# EAGLE design NodeMCU AQM-4 (EAGLE 9.6.2)
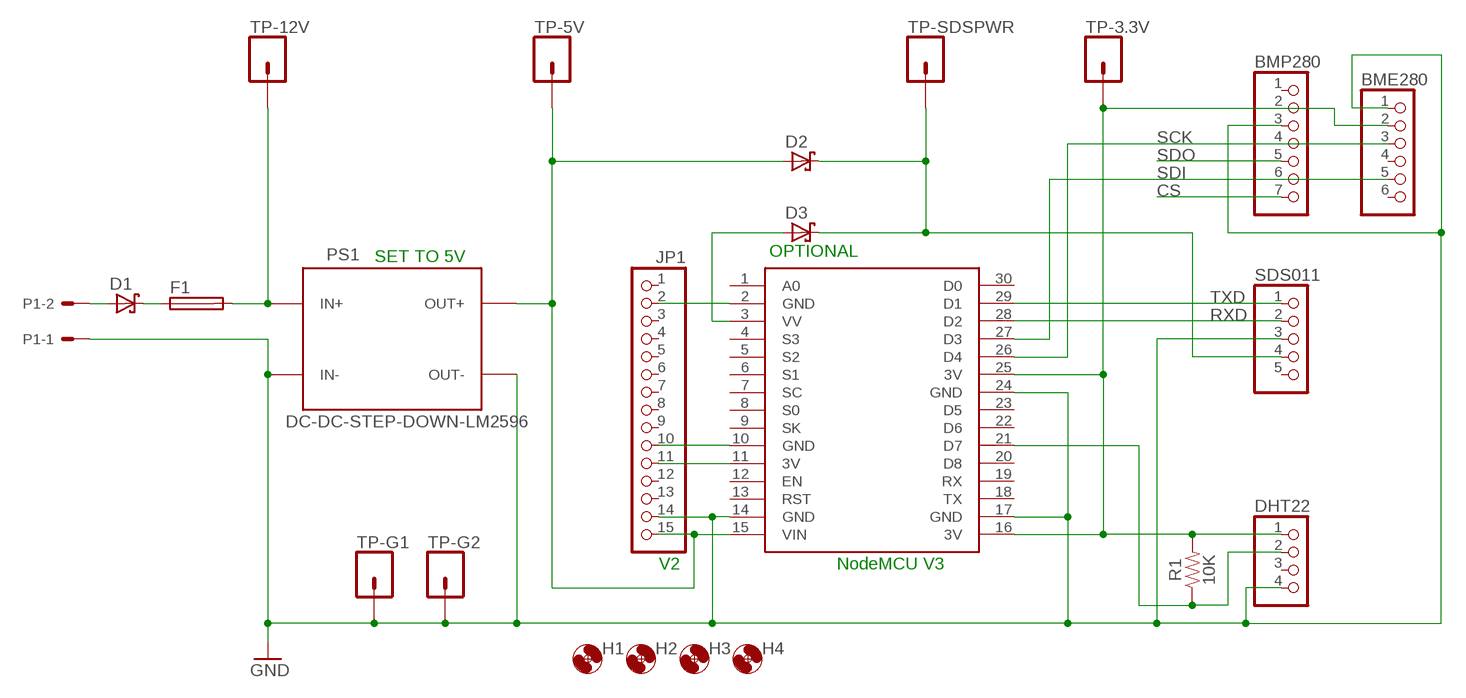
[diagram p0: schematic, sheet 1]

## Parts
BME280  PINHD-1X6  [1X06]
BMP280  PINHD-1X7  [1X07]
D1  SCHOTTKY-DIODEF126Z12  [DIODE_F126Z12]
D2  SCHOTTKY-DIODEF126Z12  [DIODE_F126Z12]
D3  SCHOTTKY-DIODEF126Z12  [DIODE_F126Z12]
DHT22  PINHD-1X4  [1X04]
F1  SH22,5A  [SH22,5A]
H1  MOUNT-HOLE3.6  [3,6]
H2  MOUNT-HOLE3.6  [3,6]
H3  MOUNT-HOLE3.6  [3,6]
H4  MOUNT-HOLE3.6  [3,6]
JP1  PINHD-1X15  [1X15]
P1  KK-156-2  [KK-156-2]
PS1  DC-DC-STEP-DOWN-LM2596  [DC-DC-STEP-DOWN-LM2596]
R1  10K  1KOHM-HORIZ-1/4W-5%  [AXIAL-0.3]
SDS011  PINHD-1X5  [1X05]
TP-3.3V  CONN_01OFFSET  [1X01_OFFSET]
TP-5V  CONN_01OFFSET  [1X01_OFFSET]
TP-12V  CONN_01OFFSET  [1X01_OFFSET]
TP-G1  CONN_01OFFSET  [1X01_OFFSET]
TP-G2  CONN_01OFFSET  [1X01_OFFSET]
TP-SDSPWR  CONN_01OFFSET  [1X01_OFFSET]
U$1  NODEMCU  [NODEMCU]

## Nets
3V3 [pwrgnd]: BME280.2 BMP280.2 DHT22.1 JP1.11 R1.P$2 TP-3.3V.1 U$1.11(3V) U$1.16(3V) U$1.25(3V)
CS: BMP280.7
GND [pwrgnd]: BME280.1 BMP280.3 DHT22.4 JP1.2 JP1.10 JP1.14 P1.1 PS1.IN- PS1.OUT- SDS011.3 TP-G1.1 TP-G2.1 U$1.2(GND) U$1.10(GND) U$1.14(GND) U$1.17(GND) U$1.24(GND)
N$1: D2.A(C) JP1.15 PS1.OUT+ TP-5V.1 U$1.15(VIN)
N$2: D3.A(C) U$1.3(VV)
N$3: D1.A(C) P1.2
N$15: D1.C(A) F1.1
N$16: F1.2 PS1.IN+ TP-12V.1
N$19: DHT22.2 R1.P$1 U$1.21(D7)
RXD: SDS011.2 U$1.28(D2)
SCK: BME280.3 BMP280.4 U$1.26(D4)
SDI: BME280.5 BMP280.6 U$1.27(D3)
SDO: BMP280.5
SDSPWR [pwrgnd]: D2.C(A) D3.C(A) SDS011.4 TP-SDSPWR.1
TXD: SDS011.1 U$1.29(D1)
Unconnected: BME280.4 BME280.6 BMP280.1 DHT22.3 JP1.1 JP1.3 JP1.4 JP1.5 JP1.6 JP1.7 JP1.8 JP1.9 JP1.12 JP1.13 SDS011.5 U$1.1(A0) U$1.4(S3) U$1.5(S2) U$1.6(S1) U$1.7(SC) U$1.8(S0) U$1.9(SK) U$1.12(EN) U$1.13(RST) U$1.18(TX) U$1.19(RX) U$1.20(D8) U$1.22(D6) U$1.23(D5) U$1.30(D0)

## Notes on the sheet
- OPTIONAL
- SET TO 5V
- V2 | NodeMCU V3

## Library data of the parts
BME280 = pinhead:PINHD-1X6: PIN HEADER
BMP280 = pinhead:PINHD-1X7: PIN HEADER
D1-D3 = eagle-ltspice:SCHOTTKY-DIODE: Schottky Diode; SPICEMODEL: NONE; SPICEPREFIX: D; SPICETYPE: diode
DHT22 = pinhead:PINHD-1X4: PIN HEADER
F1 = fuse:SH22,5A: FUSE HOLDER grid 22,5mm, isolated cap OGN0031 8201, Schurter (Buerklin); MPN: 0031.7701.11; OC_FARNELL: unknown; OC_NEWARK: 04F1224
H1-H4 = holes:MOUNT-HOLE: MOUNTING HOLE with drill center marker
JP1 = adafruit:PINHD-1X15: PIN HEADER
P1 = con-molex:KK-156-2: KK 156 HEADER Source: http://www.molex.com/pdm_docs/sd/026604100_sd.pdf; MF: MOLEX; OC_FARNELL: unknown; OC_NEWARK: unknown
PS1 = diy-modules:DC-DC-STEP-DOWN-LM2596: DC/DC Step-Down Regulator based on LM2596-ADJ chip LM2596 datasheet available here: http://www.ti.com/lit/ds/symlink/lm2596.pdf Click here to find device on ebay.com <http://www.ebay.com/sch/lm2596+power+regulator>
R1 = SparkFun-Resistors:1KOHM: 1kΩ resistor A resistor is a passive two-terminal electrical component that implements electrical resistance as a circuit element. Resistors act to reduce current flow, and, at the same time, act to lower voltage levels within circuits. - Wikipedia; PROD_ID: RES-08380; VALUE: 1k
SDS011 = pinhead:PINHD-1X5: PIN HEADER
TP-3.3V TP-5V TP-12V TP-G1 TP-G2 TP-SDSPWR = SparkFun-Connectors:CONN_01: Single connection point. Often used as Generic Header-pin footprint for 0.1 inch spaced/style header connections On any of the 0.1 inch spaced packages, you can populate with these: Break Away Headers - Straight <https://www.sparkfun.com/products/116> (PRT-00116) Break Away Male Headers - Right Angle <https://www.sparkfun.com/products/553> (PRT-00553) Female Headers <https://www.sparkfun.com/products/115> (PRT-00115) Break Away Headers - Machine Pin <https://www.sparkfun.com/products/117> (PRT-00117) Break Away Female Headers - Swiss Machine Pin <https://www.sparkfun.com/products/743> (PRT-00743) This device is also useful as a general connection point to wire up your design to another part of your project. Our various solder wires solder well into these plated through hole pads. Hook-Up Wire - Assortment (Stranded, 22 AWG) <https://www.sparkfun.com/products/11375> (PRT-11375) Hook-Up Wire - Assortment (Solid Core, 22 AWG) <https://www.sparkfun.com/products/11367> (PRT-11367) View the entire wire category on our website here <https://www.sparkfun.com/categories/141> Special notes: SMTSO-256-ET is a "flush mount" nut for a 4-40 screw. We mostly use this on specialty testbeds; it is a nice way to connect hardware to your PCB at an adjustable hieght. Also note, the SNAP packages are for using a snappable style connector. We sell a baggie of snaps and they are also used on two LilyPad designs: Snap Assortment - 30 pack (male and female) <https://www.sparkfun.com/products/11347> (DEV-11347) LilyPad Arduino SimpleSnap <https://www.sparkfun.com/products/10941> (DEV-10941) LilyPad SimpleSnap Protoboard <https://www.sparkfun.com/products/10940> (DEV-10940)
U$1 = nodemcu:NODEMCU

## Net classes
0 default: width 0.203 mm, clearance 0.203 mm
1 pwrgnd: width 0.508 mm, clearance 0.305 mm

## Board
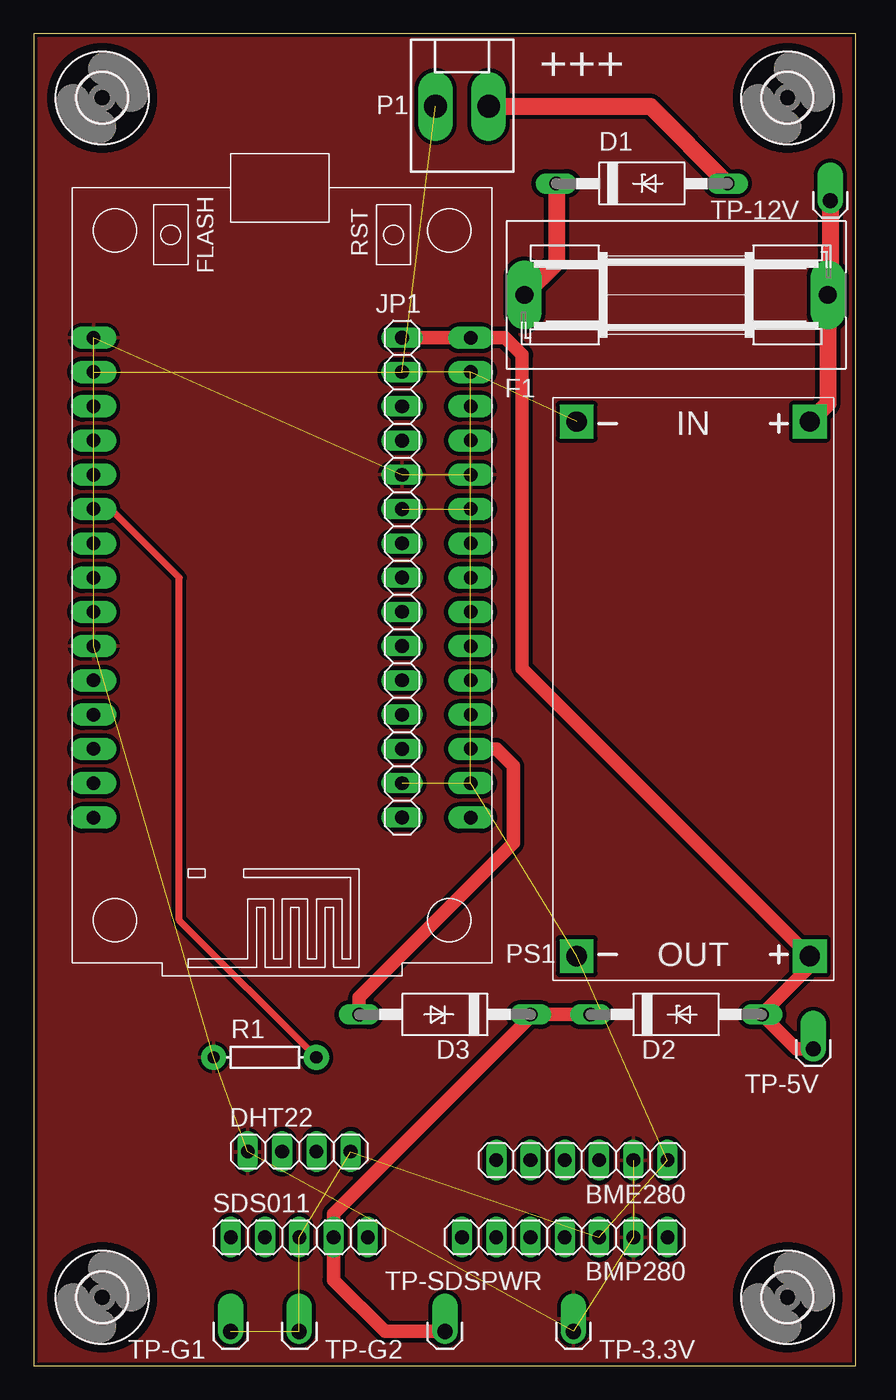
[diagram p1: board, top side]
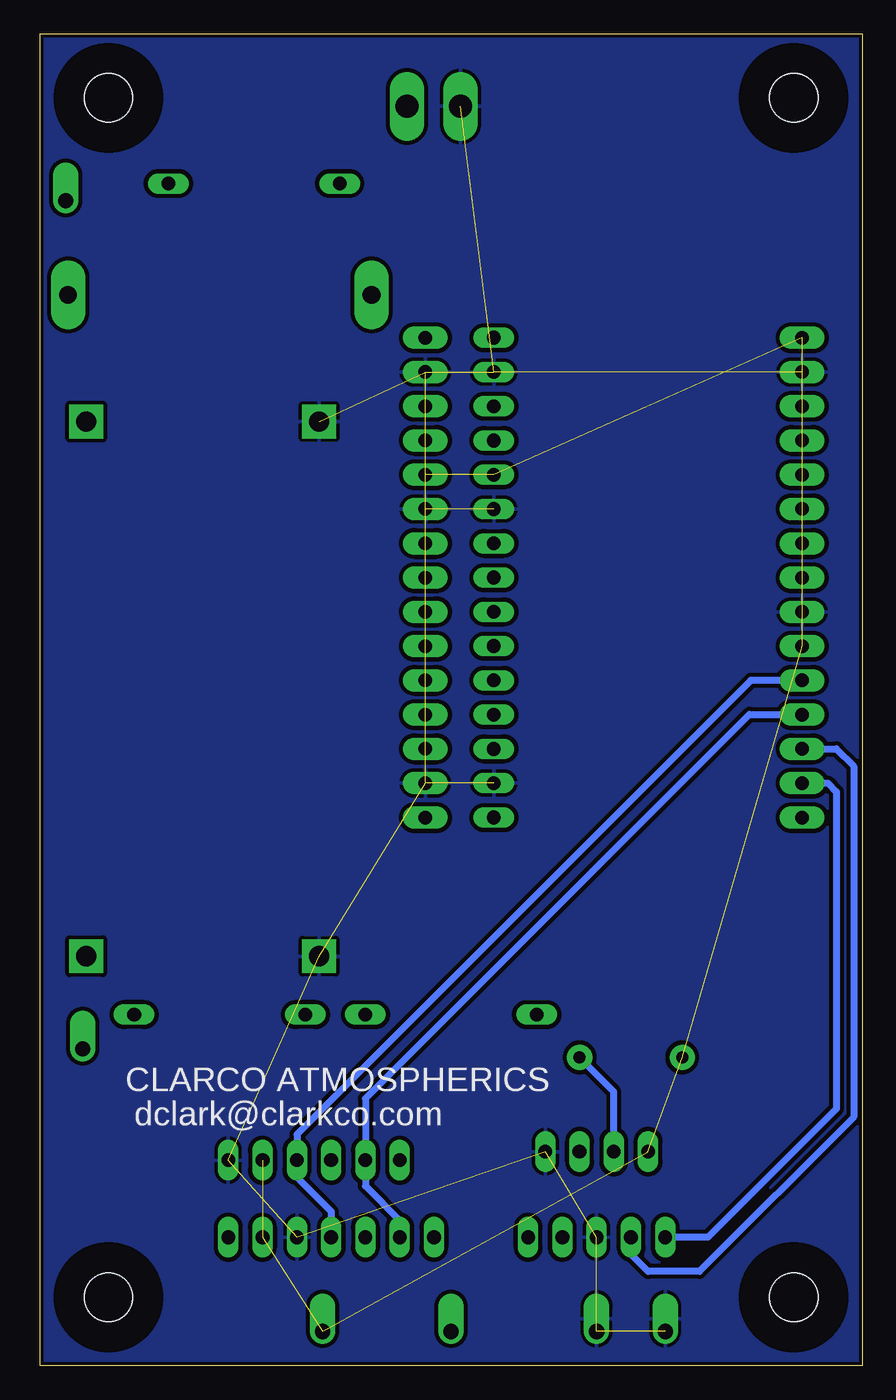
[diagram p2: board, bottom side, seen from below]

Size 60.94 x 98.73 mm. Coordinates in mm from the lower left corner, seen from the top.
Outline: 0,0 60.94,0 60.94,98.73 0,98.73 0,0
Copper layers (1*16): Top 0.035mm / dielectric 1.5mm / Bottom 0.035mm
Design rules "dirt_cheap_dirty_boards.v1.1": minimum track width 6mil, minimum drill 12mil, track to track 6mil, track to pad 6mil, pad to pad 6mil, via to via 6mil, smd to smd 0mil, copper to edge 10mil, drill to drill 10mil, minimum pad ring 10mil, minimum via ring 6mil, stop-mask expansion 2mil, vias tented up to drill 25mil, thermal gap 10mil

### Footprints (pad centres in the part's own frame; a part is rotated, then mirrored left to right if it is on the bottom)
1X06 = drill 1.016 long: 1 -6.35,0; 2 -3.81,0; 3 -1.27,0; 4 1.27,0; 5 3.81,0; 6 6.35,0
1X07 = drill 1.016 long: 1 -7.62,0; 2 -5.08,0; 3 -2.54,0; 4 0,0; 5 2.54,0; 6 5.08,0; 7 7.62,0
DIODE_F126Z12 = drill 1.016 long: A 6.35,0; C -6.35,0
1X04 = drill 1.016 long: 1 -3.81,0; 2 -1.27,0; 3 1.27,0; 4 3.81,0
SH22,5A = drill 1.321 pad 2.54 long: 1 -11.252,0; 2 11.252,0
3,6 = hole 3.6: 0,0
1X15 = drill 1.016 long: 1 -17.78,0; 2 -15.24,0; 3 -12.7,0; 4 -10.16,0; 5 -7.62,0; 6 -5.08,0; 7 -2.54,0; 8 0,0; 9 2.54,0; 10 5.08,0; 11 7.62,0; 12 10.16,0; 13 12.7,0; 14 15.24,0; 15 17.78,0
KK-156-2 = drill 1.7 pad 2.184 long: 1 -1.98,0; 2 1.98,0
DC-DC-STEP-DOWN-LM2596 = drill 1.5 pad 2.5 square: IN+ -19.812,8.636; IN- -19.812,-8.636; OUT+ 19.812,8.636; OUT- 19.812,-8.636
AXIAL-0.3 = drill 0.9 pad 1.88: P$1 -3.81,0; P$2 3.81,0
1X05 = drill 1.016 long: 1 -5.08,0; 2 -2.54,0; 3 0,0; 4 2.54,0; 5 5.08,0
1X01_OFFSET = drill 1.118 pad 1.88 offset: 1 0,0
NODEMCU = drill 1 pad 1.676 long: 1 -13.97,17.78; 2 -13.97,15.24; 3 -13.97,12.7; 4 -13.97,10.16; 5 -13.97,7.62; 6 -13.97,5.08; 7 -13.97,2.54; 8 -13.97,0; 9 -13.97,-2.54; 10 -13.97,-5.08; 11 -13.97,-7.62; 12 -13.97,-10.16; 13 -13.97,-12.7; 14 -13.97,-15.24; 15 -13.97,-17.78; 16 13.97,-17.78; 17 13.97,-15.24; 18 13.97,-12.7; 19 13.97,-10.16; 20 13.97,-7.62; 21 13.97,-5.08; 22 13.97,-2.54; 23 13.97,0; 24 13.97,2.54; 25 13.97,5.08; 26 13.97,7.62; 27 13.97,10.16; 28 13.97,12.7; 29 13.97,15.24; 30 13.97,17.78

### Placement (x,y rotation side)
BME280  40.64,15.24 180 top
BMP280  39.37,9.53 180 top
D1  45.08,87.63 0 top
D2  47.62,26.04 0 top
D3  30.48,26.04 180 top
DHT22  19.68,15.88 0 top
F1  47.62,79.38 0 top
H1  5.08,93.98 0 top
H2  5.08,5.08 0 top
H3  55.88,5.08 0 top
H4  55.88,93.98 0 top
JP1  27.3,58.42 90 top
P1  31.75,93.34 0 top
PS1  48.89,50.16 270 top
R1  17.14,22.86 180 top
SDS011  19.68,9.53 0 top
TP-3.3V  40,2.54 0 top
TP-5V  57.78,23.5 0 top
TP-12V  59.05,86.36 0 top
TP-G1  14.61,2.54 0 top
TP-G2  19.68,2.54 0 top
TP-SDSPWR  30.48,2.54 0 top
U$1  18.41,58.42 180 top

### Tracks (layer width: path | path; a pad name or v marks a point on that pad's centre or on a via)
3V3  (8 unrouted)
  pour Top: -1.27,100.33 62.23,100.33 62.23,-1.27 -1.27,-1.27
GND  (16 unrouted)
  pour Bottom: -0.64,99.7 61.59,99.7 61.59,-0.64 -0.64,-0.64
N$1
  Top 1.016: TP-5V.1 56.51,23.5 D2.A 57.53,29.59 PS1.OUT+ 36.2,51.69 36.2,74.93 34.92,76.2 U$1.15 JP1.15
N$2
  Top 1.016: U$1.3 34.29,45.72 35.56,44.45 35.56,38.73 24.13,27.3 D3.A
N$3
  Top 1.27: P1.2 45.72,93.34 D1.A
N$15
  Top 1.27: D1.C 38.73,81.74 F1.1
N$16
  Top 0.61: 59.05,79.55 F1.2
  Top 1.27: TP-12V.1 59.05,79.55 | F1.2 58.88,71.32 PS1.IN+
N$19
  Top 0.508: R1.P$1 10.79,33.02 10.79,58.42 5.71,63.5 U$1.21
  Bottom 0.508: DHT22.2 18.41,20.32 R1.P$1
RXD
  Bottom 0.508: U$1.28 1.9,45.72 0.64,44.45 0.64,18.41 12.07,6.99 15.88,6.99 17.14,8.26 SDS011.2
SCK
  Bottom 0.508: U$1.26 8.26,50.8 41.91,17.14 BME280.3 41.91,13.97 39.37,11.43 BMP280.4
SDI
  Bottom 0.508: U$1.27 4.47,48.28 8.36,48.28 36.83,19.82 BME280.5 36.83,13.34 34.29,10.79 BMP280.6
SDSPWR
  Top 0.61: D3.C 36.83,25.87
  Top 1.016: D2.C D3.C | 36.83,25.87 22.23,11.27 SDS011.4 22.23,6.35 26.04,2.54 TP-SDSPWR.1
TXD
  Bottom 0.508: SDS011.1 11.43,9.53 1.9,19.05 1.9,42.54 2.54,43.18 U$1.29

### Text on the board
bPlace: CLARCO ATMOSPHERICS | dclark@clarkco.com
tNames: +++